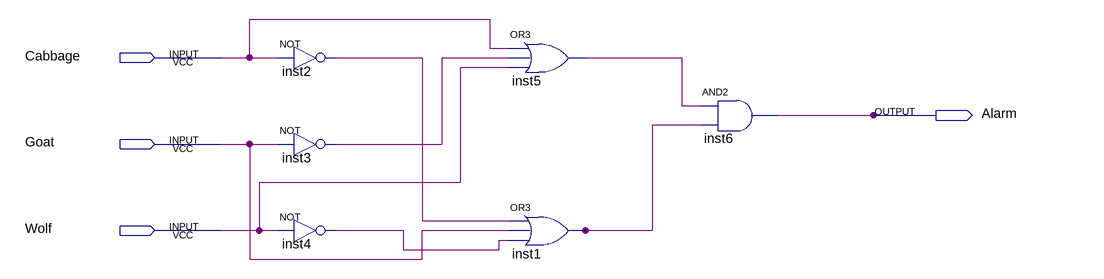
[diagram p0: schematic sheet]
// Quartus schematic lab3step0.bdf as structural Verilog: 6 symbols, 4 pins
module lab3step0 (
  input  Cabbage,
  input  Goat,
  input  Wolf,
  output Alarm
);

  wire inst1_out, inst2_out, inst3_out, inst4_out, inst5_out;

  not inst2 (inst2_out, Cabbage);
  not inst3 (inst3_out, Goat);
  not inst4 (inst4_out, Wolf);
  or inst5 (inst5_out, Cabbage, inst3_out, Wolf);
  or inst1 (inst1_out, inst2_out, Goat, inst4_out);
  and inst6 (Alarm, inst5_out, inst1_out);
endmodule
